# Altium schematic sheet EEP.SchDoc
size A4
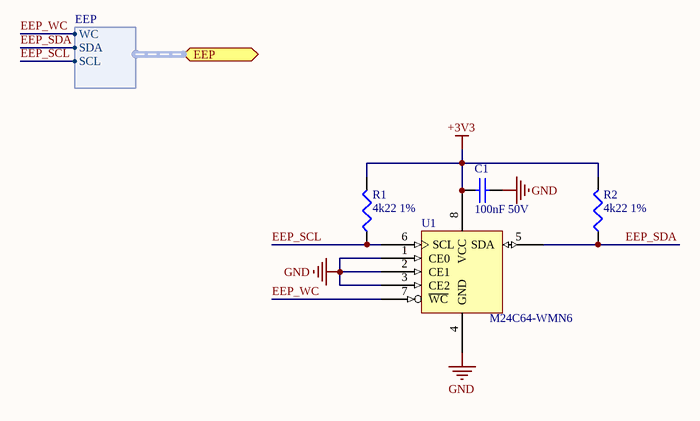
[diagram p0: EEP.SchDoc]

## Parts
C1  100nF 50V  [CAPC2012N]
R1  4k22 1%  [RESC2012N]
R2  4k22 1%  [RESC2012N]
U1  M24C64-WMN6  [SO8_M]

## Ports
EEP (harness EEP)

## Harnesses
EEP: WC, SDA, SCL

## Nets
+3V3: C1.1 R1.2 R2.2 U1.8(VCC)  [also labelled VCC]
GND: C1.2 U1.1(CE0) U1.2(CE1) U1.3(CE2) U1.4(GND)
EEP_SCL: R1.1 U1.6(SCL) ; port EEP.SCL
EEP_SDA: R2.1 U1.5(SDA) ; port EEP.SDA
EEP_WC: U1.7(~{WC}) ; port EEP.WC

## Library data of the parts
C1 = CAP: Capacitor
R1 R2 = Res3: Resistor; Published: 8-Jun-2000; LatestRevisionDate: 04-Mar-2005; LatestRevisionNote: PCB Footprint replaced.; PackageReference: J1-0603; Publisher: Altium Limited
U1 = ST24E64B6(8): Serial Extended Addressing Compatible With I2C Bus 64K(8K x 8) EEPROM; Manufacturer: ST; Price: 0.85